# Altium schematic sheet HTDC.SchDoc
size Letter; SheetNumber: 3; SheetTotal: 3
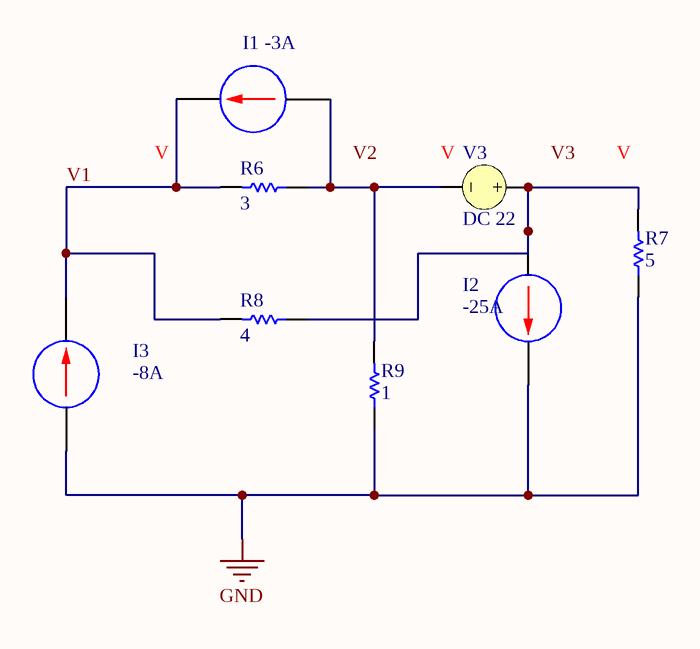
[diagram p0: HTDC.SchDoc]

## Parts
I1  DC: -3A  (hidden comment: DC Current Source)
I2  DC: -25A  (hidden comment: DC Current Source)
I3  DC: -8A  (hidden comment: DC Current Source)
R6  value 3  (hidden comment: Resistor)
R7  value 5  (hidden comment: Resistor)
R8  value 4  (hidden comment: Resistor)
R9  value 1  (hidden comment: Resistor)
V3  DC 22

## Nets
GND: I2.1(+) I3.2(-) R7.1 R9.1
V1: I1.1(+) I3.1(+) R6.2 R8.2
NetI1_2: I1.2(-) R6.1 R9.2 V3.2
NetI2_2: I2.2(-) R7.2 R8.1 V3.1

## Notes on the sheet
- Labels drawn without touching a wire or pin: V2, V3
- Proyecto:
- Documento:
- Autor:
- Carnet:
- Fecha:
- Revisión:
- Curso:
- Tamaño:
- Hoja:
- de
- Carta

## Library data of the parts
I1-I3 = DC Current Source: SimulationGenericComponent: True
R6-R9 = Resistor: TC1: 0; SimulationGenericComponent: True; TC2: 0
V3 = VSRC: Voltage Source; Note: PCB Footprint - Not required; AC Magnitude: 1; AC Phase: 0; Value: 22; Published: 8-Jun-2000; LatestRevisionDate: 17-Jul-2002; LatestRevisionNote: Re-released for DXP Platform.; PackageReference: Not Applicable; Publisher: Altium Limited